# Altium project MosfetInverterProject.PrjPcb
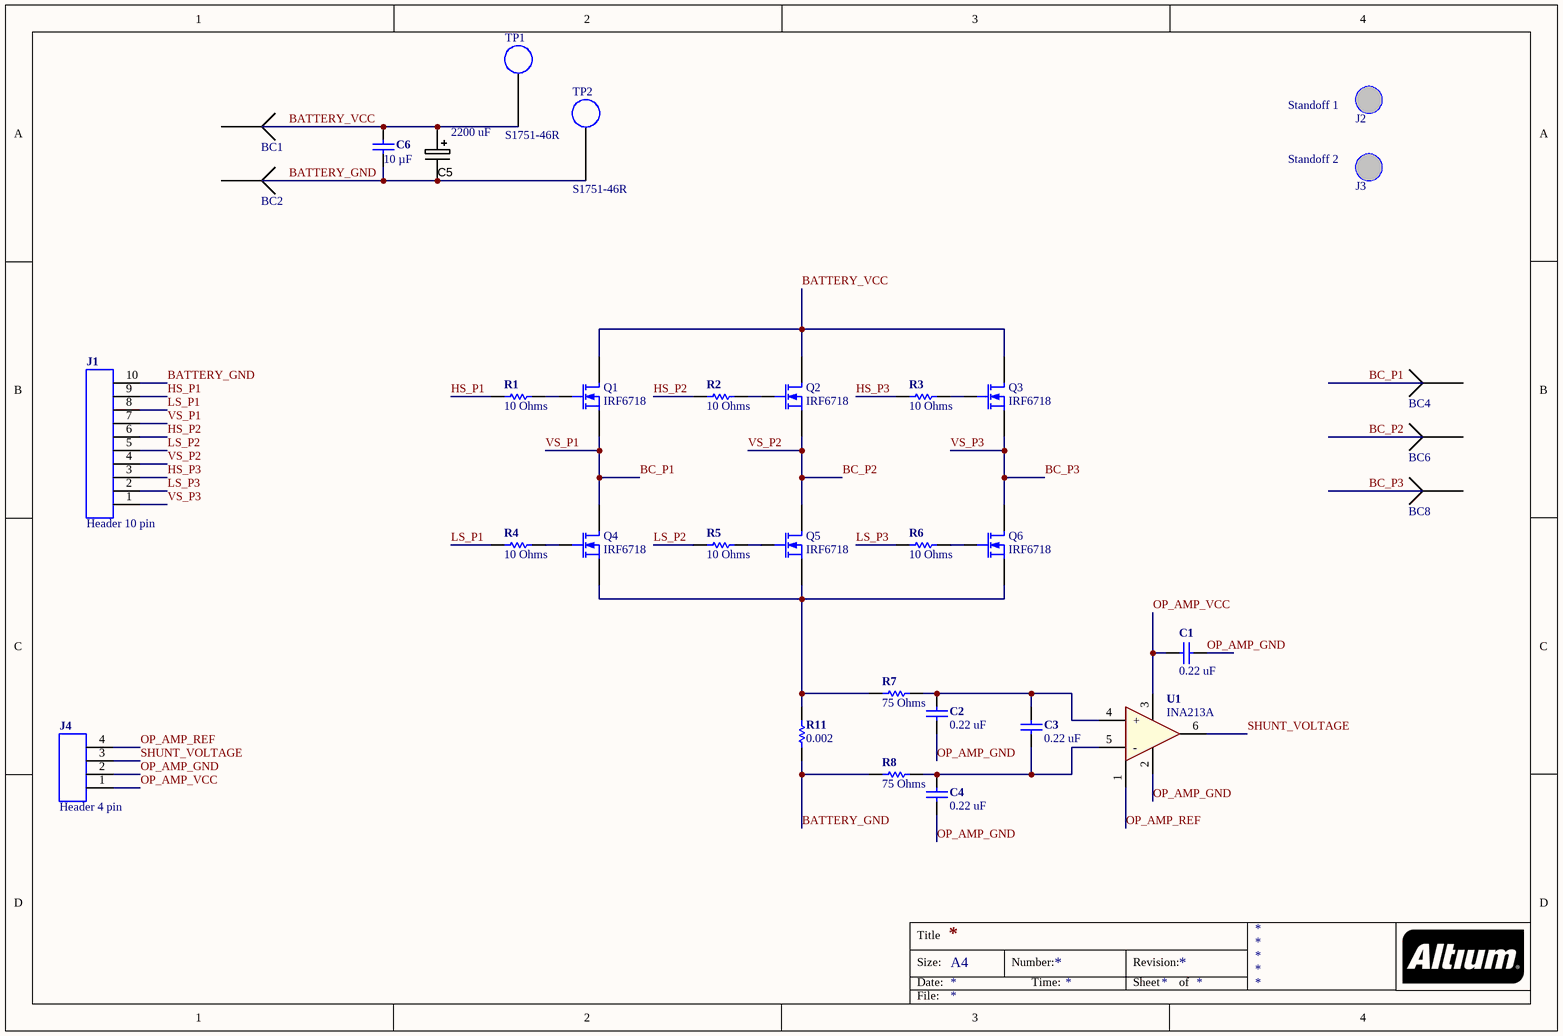
[diagram p0: MISchematic.SchDoc]
1 sheet, 33 parts. Net scope: global (net labels, ports and power ports of the same name join across sheets).
Board file: MIPCB.PcbDoc

## Sheet MISchematic.SchDoc
size A4

### Parts
BC1  Bullet Connector Top  [BULLET_CONNECTOR_TOP]  (value not drawn)
BC2  Bullet Connector Top  [BULLET_CONNECTOR_TOP]  (value not drawn)
BC4  Bullet Connector Top  [BULLET_CONNECTOR_TOP]  (value not drawn)
BC6  Bullet Connector Top  [BULLET_CONNECTOR_TOP]  (value not drawn)
BC8  Bullet Connector Top  [BULLET_CONNECTOR_TOP]  (value not drawn)
C1  0.22 uF  [CAP-0805(2012)-R]
C2  0.22 uF  [CAP-0805(2012)-R]
C3  0.22 uF  [CAP-0805(2012)-R]
C4  0.22 uF  [CAP-0805(2012)-R]
C5  (no value)  [2200uF_Rad_18x25mm]
C6  10 µF  [CAP-1210(3225)-R]
J1  Header 10 pin  [HEADER-10-100MIL]
J2  Stand-off  [6-32 Threaded Standoff]  (value not drawn)
J3  Stand-off  [6-32 Threaded Standoff]  (value not drawn)
J4  Header 4 pin  [HEADER-4-100mil]
Q1  IRF6718  [DirectFet-7]
Q2  IRF6718  [DirectFet-7]
Q3  IRF6718  [DirectFet-7]
Q4  IRF6718  [DirectFet-7]
Q5  IRF6718  [DirectFet-7]
Q6  IRF6718  [DirectFet-7]
R1  10 Ohms  [R-0805(2012)-R]
R2  10 Ohms  [R-0805(2012)-R]
R3  10 Ohms  [R-0805(2012)-R]
R4  10 Ohms  [R-0805(2012)-R]
R5  10 Ohms  [R-0805(2012)-R]
R6  10 Ohms  [R-0805(2012)-R]
R7  75 Ohms  [R-0805(2012)-R]
R8  75 Ohms  [R-0805(2012)-R]
R11  0.002  [WSHM28182L000FEB]
TP1  S1751-46R  [S1751-46R]
TP2  S1751-46R  [S1751-46R]
U1  INA213A  [SOT-6]

### Nets
BATTERY_GND: BC2.1 C5.2 C6.2 J1.10 R8.1 R11.1 TP2.1
BATTERY_VCC: BC1.1 C5.1 C6.1 Q1.2(D) Q2.2(D) Q3.2(D) TP1.1
BC_P1: BC4.1 J1.7 Q1.3(S) Q4.2(D)  [also labelled VS_P1]
BC_P2: BC6.1 J1.4 Q2.3(S) Q5.2(D)  [also labelled VS_P2]
BC_P3: BC8.1 J1.1 Q3.3(S) Q6.2(D)  [also labelled VS_P3]
HS_P1: J1.9 R1.2
HS_P2: J1.6 R2.2
HS_P3: J1.3 R3.2
LS_P1: J1.8 R4.2
LS_P2: J1.5 R5.2
LS_P3: J1.2 R6.2
OP_AMP_GND: C1.2 C2.2 C4.2 J4.2 U1.2(GND)
OP_AMP_REF: J4.4 U1.1(REF)
OP_AMP_VCC: C1.1 J4.1 U1.3(VCC)
SHUNT_VOLTAGE: J4.3 U1.6(OUT)
NetC2_1: C2.1 C3.1 R7.2 U1.4(+)
NetC3_2: C3.2 C4.1 R8.2 U1.5(-)
NetQ1_1: Q1.1(G) R1.1
NetQ2_1: Q2.1(G) R2.1
NetQ3_1: Q3.1(G) R3.1
NetQ4_1: Q4.1(G) R4.1
NetQ4_3: Q4.3(S) Q5.3(S) Q6.3(S) R7.1 R11.2
NetQ5_1: Q5.1(G) R5.1
NetQ6_1: Q6.1(G) R6.1

### Notes on the sheet
- (near J2) Standoff 1
- (near J3) Standoff 2
- Title
- Size:
- Date:
- A4
- Number:
- Time:
- Revision:
- Sheet
- of
- File:
- (in symbol CAP_2200uF_50V_THT) 2200 uF

### Library data of the parts
BC1 BC2 BC4 BC6 BC8 = Bullet Connector Top: SMD BULLET CONNECTOR
C1-C4 = CAP- 0.22 uF- 16 V-CER-0805(1202): CAP CER 0.22 UF 16V 10% X7R 0805(2012); Manufacturer: Yageo; Manufacturer Part Number: CC0805KRX7R7BB224; Type: Multilayer Ceramic Chip Capacitor; Voltage Rating DC: 16 VDC; Capacitance - nF: 220 nF; Capacitance - pF: 220000 pF; Supplier 1: Mouser; RoHS: RoHS Compliant By Exemption; Category: Multilayer Ceramic Capacitors MLCC - SMD/SMT; Stock 1: 9302; Pricing 1: 1=0.100, 10=0.088, 100=0.039, 1000=0.032, 4000=0.023, 8000=0.022, 24000=0.021, 48000=0.019, 100000=0.016 (USD); Capacitance: 0.22 uF; Length: 2 mm; Package / Case: 0805 (2012 metric); Packaging: Reel; Product: General Type MLCCs; Termination Style: SMD/SMT; Tolerance: 10 %; Width: 1.25 mm; Brand: Yageo; Case Code - in: 0805; Case Code - mm: 2012; Dielectric: X7R; Maximum Operating Temperature: + 125 C; Minimum Operating Temperature: - 55 C; Standard Pack Qty: 4000; RoHS - Mouser: E; Minimum Order Quantity: 1; Reeling: True; ComponentLink1URL: http://www.mouser.com/ds/2/447/Yageo_486313-494411.pdf; ComponentLink1Description: http://www.mouser.com/ds/2/447/Yageo_486313-494411.pdf; Supplier Part Number 1: 603-CC805KRX7R7BB224
C5 = CAP_2200uF_50V_THT: Capacitor THT Alum Elec 2200uF 20% 50V; Manufacturer 1: NICHICON; Manufacturer Part Number 1: UVK1H222MHD; Ratings: 50V; 105°C; Material: Al Electrolytic; Package / Case: Radial; Tolerance: ±20%
C6 = CAP- 10 uF- 50 V-CER-1210(3225): CAP CER 10 UF 50V 10% X5R 1210; MANUFACTURER: Yageo; Part #:: CC1210KKX7R9BB106; Voltage - Rated: V; Tolerance: ±%; RoHS: RoHS Compliant; Category: Capacitors; Capacitance: 10 µF; Mounting Type: Surface Mount, MLCC; Applications: General Purpose; Package / Case: 0603 (1608 Metric); Size / Dimension: 0.063" L x 0.031" W (1.60mm x 0.80mm); Thickness (Max): 0.035" (0.90mm)
J1 = CON-10Pin-100Mil: Header, 10pin, .1 pitch; PART #:: 90136-1110; MANUFACTURER: Molex
J4 = CON-4Pin-100Mil: Header, 4 pin, .1 pitch; ARMA_PN: 51-000044-ARD
Q1-Q6 = IRF6718: IRF6718L2TRPBF; Published: 8-Jun-2000; LatestRevisionDate: 17-Jul-2002; LatestRevisionNote: Re-released for DXP Platform.; PackageVersion: 1995/1996; PackageReference: E3; Publisher: Altium Limited; PackageDescription: TO, Flat Index; 3 In-Line, Axial Leads; Body Dia. 4.6mm; Lead Dia. 0.5 mm (max)
R1-R6 = R-10-125mW-0805: RES 10 OHM 1/8W 0805 SMD; Manufacturer: Yageo; Manufacturer Part Number: RC0805FR-0710RL; Power Rating: 125 mW (1/8 W); Temperature Coefficient: 200 PPM / C; Tolerance: 1 %; Voltage Rating: 150 V; RoHS: RoHS Compliant; Category: Thick Film Resistors - SMD; Packaging: Reel; Resistance: 10 Ohms; Package / Case: 0805 (2012 metric); Height: 0.5 mm; Supplier 1: Mouser; Stock 1: 46426; Pricing 1: 1=0.100, 10=0.016, 100=0.006, 1000=0.004, 5000=0.003, 25000=0.002 (USD); Length: 2 mm; Operating Temperature Range: - 55 C to + 155 C; Product: Thick Film Resistors General Purpose; Series: RC; Termination Style: SMD/SMT; Type: General Purpose Chip Resistor Surface Mount; Width: 1.25 mm; Brand: Yageo; Case Code - in: 0805; Case Code - mm: 2012; Product Category: 0805 SMD Chip Resistors; Standard Pack Qty: 5000; RoHS - Mouser: Y; Minimum Order Quantity: 1; Reeling: True; ComponentLink1URL: http://www.mouser.com/ds/2/447/RC0805-257173.pdf; ComponentLink1Description: http://www.mouser.com/ds/2/447/RC0805-257173.pdf; Supplier Part Number 1: 603-RC0805FR-0710RL
R7 R8 = R-75-62.5 mW-0805(2012): RES 75OHM 125 mW 0805(2012) SMD; Manufacturer: Yageo; Manufacturer Part Number: RC0805FR-0775RL; Power Rating: 125 mW (1/8 W); Temperature Coefficient: 100 PPM / C; Tolerance: 1 %; Voltage Rating: 150 V; Supplier 1: Mouser; RoHS: RoHS Compliant; Category: Thick Film Resistors - SMD; Stock 1: 64794; Pricing 1: 1=0.100, 10=0.016, 100=0.006, 1000=0.004, 5000=0.003, 25000=0.002 (USD); Features: RC0805 series chip resistors with lead-free terminations; Height: 0.5 mm; Length: 2 mm; Operating Temperature Range: - 55 C to + 155 C; Package / Case: 0805 (2012 metric); Packaging: Reel; Product: Thick Film Resistors General Purpose; Resistance: 75 Ohms; Series: RC; Termination Style: SMD/SMT; Type: General Purpose Chip Resistor Surface Mount; Width: 1.25 mm; Brand: Yageo; Case Code - in: 0805; Case Code - mm: 2012; Standard Pack Qty: 5000; RoHS - Mouser: Y; Minimum Order Quantity: 1; Reeling: True; ComponentLink1URL: http://www.mouser.com/ds/2/447/Yageo_08112016_RC0805-968729.pdf; ComponentLink1Description: http://www.mouser.com/ds/2/447/Yageo_08112016_RC0805-968729.pdf; Supplier Part Number 1: 603-RC0805FR-0775RL
R11 = WSHM28182: RES  0.002 OHM  7W 2818(7146)-SMD; Manufacturer: Vishay/Dale; Manufacturer Part Number: WSHM28182L000FEA; RoHS: RoHS Compliant; Category: Resistors; Resistance: 0.002; Power (Watts): 7 W; Composition: Thick Film; Package / Case: 2818 (7146 Metric); Supplier Device Package: 2818 (7146); Size / Dimension: 0.063" L x 0.031" W (1.60mm x 0.80mm); Height: 0.022" (0.55mm); Number of Terminations: 4
TP1 TP2 = S1751-46R: PC TEST POINT TIN SMD; Manufacturer: Harwin Inc.; Supplier 1: Digi-Key; RoHS: RoHS Compliant; Stock 1: 275112; Pricing 1: 1=0.29, 10=0.272, 25=0.2324, 50=0.2032, 100=0.1888, 250=0.167, 500=0.15972, 1000=0.13068 (USD); Packaging: Cut Tape (CT); Type: PC Test Point; Terminal: 0.128" x 0.065" x 0.079" (3.25mm x 1.65mm x 2.00mm) Brass, Tin Plated; Mounting Type: Surface Mount; Material: Copper Alloy; Color: Natural; ComponentLink1URL: http://cdn.harwin.com/pdfs/S1751.pdf; ComponentLink1Description: http://cdn.harwin.com/pdfs/S1751.pdf; Supplier Part Number 1: 952-1478-1-ND; Manufacturer Part Number: S1751-46R; Category: Test and Measurement
U1 = OP-AMP-CURRENT-SENSE: IC, OP AMP, CMOS; Part #:: INA213AQDCKRQ1; MANUFACTURER: TI; Value: INA213A